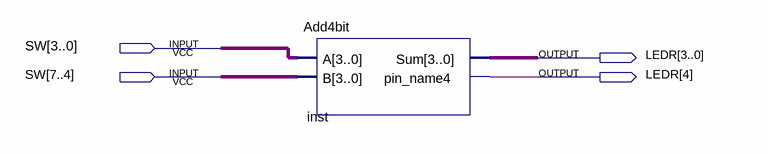
[diagram p0: schematic sheet]
// Quartus schematic TestAdder.bdf as structural Verilog: 1 symbols, 4 pins
module TestAdder (
  input  [7:0] SW,
  output [4:0] LEDR
);

  Add4bit inst (.A(SW[3:0]), .B(SW[7:4]), .Sum(LEDR[3:0]), .pin_name4(LEDR[4]));
endmodule
